# EAGLE design ion_engine (EAGLE 9.5.0)
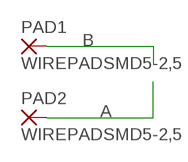
[diagram p0: schematic, sheet 1]

## Parts
PAD1  WIREPADSMD5-2,5  [5-2,5]
PAD2  WIREPADSMD5-2,5  [5-2,5]

## Nets
A: PAD2.1(P)
B: PAD1.1(P)

## Library data of the parts
PAD1 PAD2 = wirepad:WIREPAD: Wire PAD connect wire on PCB

## Board
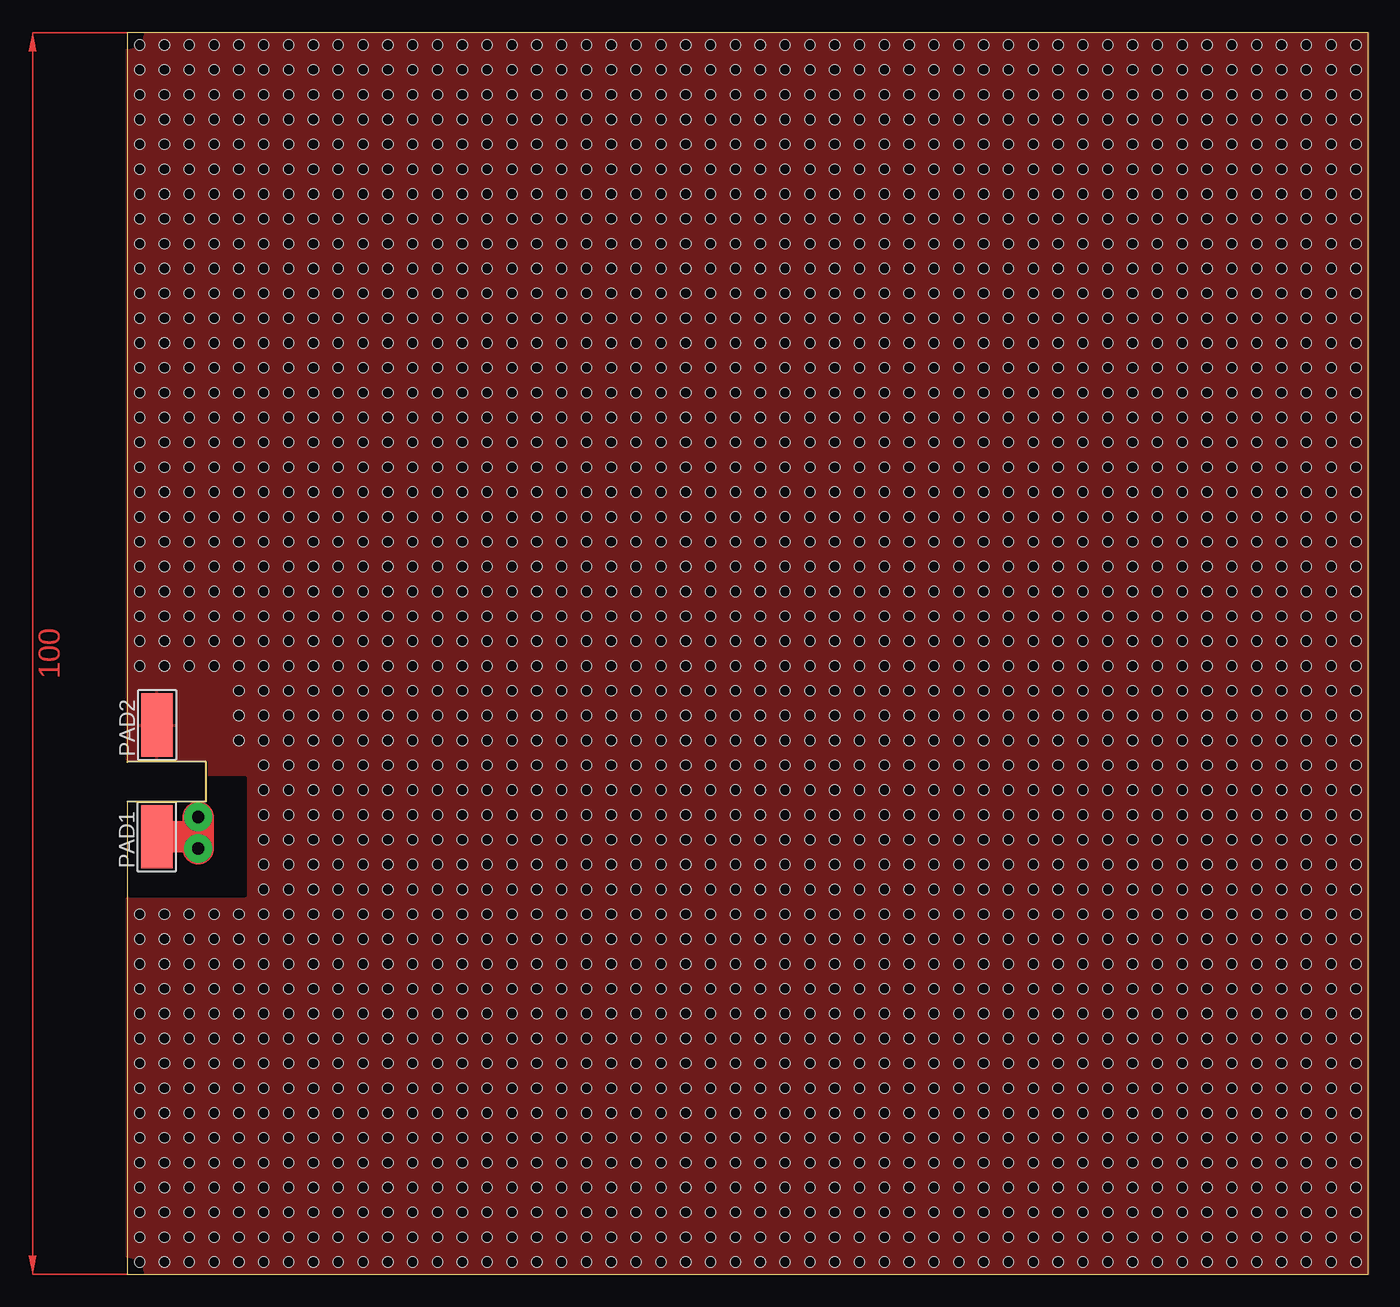
[diagram p1: board, top side]
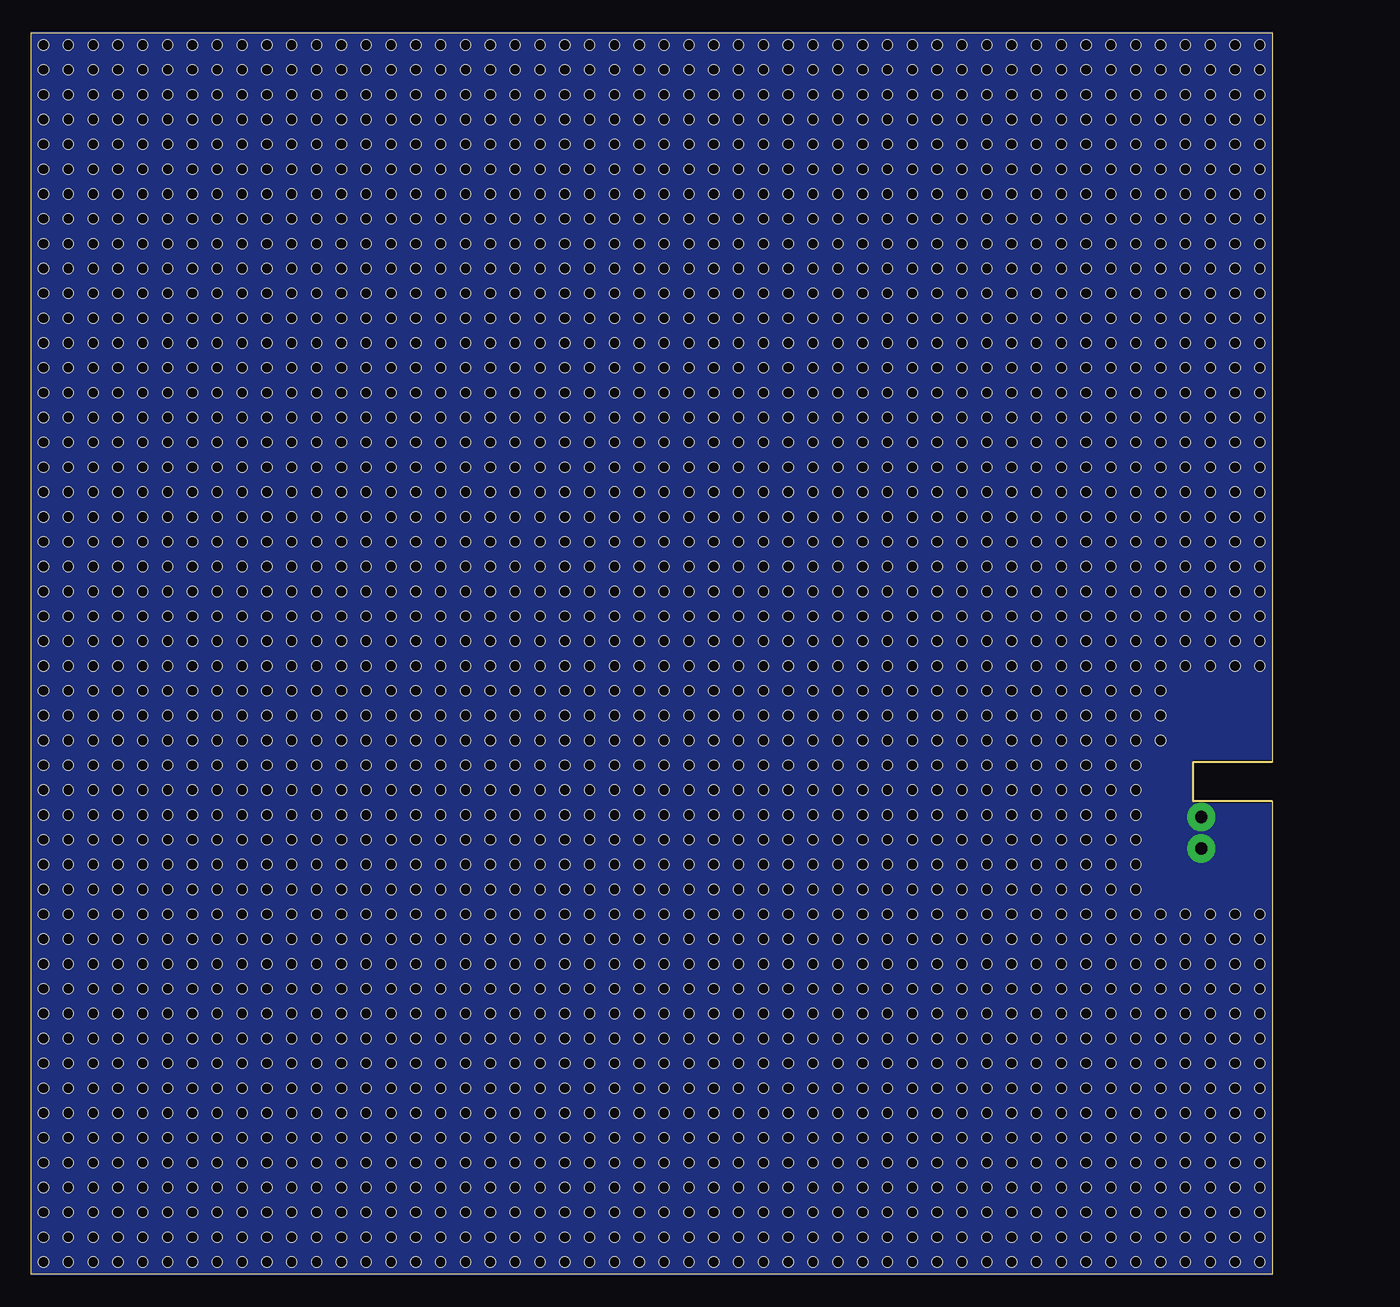
[diagram p2: board, bottom side, seen from below]

Size 100 x 100 mm. Coordinates in mm from the lower left corner, seen from the top.
Outline: 0,0 100,0 100,100 0,100 0,41.27 6.35,41.27 6.35,38.1 0,38.1 0,0
Copper layers (1*16): Top 0.035mm / dielectric 1.5mm / Bottom 0.035mm
Design rules "default *": minimum track width 6mil, minimum drill 0.35mm, track to track 50mil, track to pad 50mil, pad to pad 50mil, via to via 50mil, smd to smd 0mil, copper to edge 0mil, drill to drill 0mil, minimum pad ring 10mil, minimum via ring 8mil, stop-mask expansion 4mil, vias tented up to drill 0mil, thermal gap 10mil
Holes 0.8 mm at 1,99 3,99 5,99 7,99 9,99 11,99 13,99 15,99 17,99 19,99 21,99 23,99 25,99 27,99 27,99 29,99 31,99 33,99 35,99 37,99 39,99 41,99 43,99 45,99 47,99 49,99 51,99 53,99 55,99 55,99 57,99 59,99 61,99 61,99 63,99 65,99 67,99 69,99 71,99 73,99 75,99 77,99 79,99 79,99 81,99 83,99 85,99 87,99 89,99 91,99 93,99 95,99 97,99 99,99 1,97 3,97 5,97 7,97 9,97 11,97 13,97 15,97 17,97 19,97 21,97 23,97 25,97 27,97 27,97 29,97 31,97 33,97 35,97 37,97 39,97 41,97 43,97 45,97 47,97 49,97 51,97 53,97 55,97 55,97 57,97 59,97 61,97 61,97 63,97 65,97 67,97 69,97 71,97 73,97 75,97 77,97 79,97 79,97 81,97 83,97 85,97 87,97 89,97 91,97 93,97 95,97 97,97 99,97 1,95 3,95 5,95 7,95 9,95 11,95 13,95 15,95 17,95 19,95 21,95 23,95 25,95 27,95 27,95 29,95 31,95 33,95 35,95 37,95 39,95 41,95 43,95 45,95 47,95 49,95 51,95 53,95 55,95 55,95 57,95 59,95 61,95 61,95 63,95 65,95 67,95 69,95 71,95 73,95 75,95 77,95 79,95 79,95 81,95 83,95 85,95 87,95 89,95 91,95 93,95 95,95 97,95 99,95 1,93 3,93 5,93 7,93 9,93 11,93 13,93 15,93 17,93 19,93 21,93 23,93 25,93 27,93 27,93 29,93 31,93 33,93 35,93 37,93 39,93 41,93 43,93 45,93 47,93 49,93 51,93 53,93 55,93 55,93 57,93 59,93 61,93 61,93 63,93 65,93 67,93 69,93 71,93 73,93 75,93 77,93 79,93 79,93 81,93 83,93 85,93 87,93 89,93 91,93 93,93 95,93 97,93 99,93 1,91 3,91 5,91 7,91 9,91 11,91 13,91 15,91 17,91 19,91 21,91 23,91 25,91 27,91 27,91 29,91 31,91 33,91 35,91 37,91 39,91 41,91 43,91 45,91 47,91 49,91 51,91 53,91 55,91 55,91 57,91 59,91 61,91 61,91 63,91 65,91 67,91 69,91 71,91 73,91 75,91 77,91 79,91 79,91 81,91 83,91 85,91 87,91 89,91 91,91 93,91 95,91 97,91 99,91 1,89 3,89 5,89 7,89 9,89 11,89 13,89 15,89 17,89 19,89 21,89 23,89 25,89 27,89 27,89 29,89 31,89 33,89 35,89 37,89 39,89 41,89 43,89 45,89 47,89 49,89 51,89 53,89 55,89 55,89 57,89 59,89 61,89 61,89 63,89 65,89 67,89 69,89 71,89 73,89 75,89 77,89 79,89 79,89 81,89 83,89 85,89 87,89 89,89 91,89 93,89 95,89 97,89 99,89 1,87 3,87 5,87 7,87 9,87 11,87 13,87 15,87 17,87 19,87 21,87 23,87 25,87 27,87 27,87 29,87 31,87 33,87 35,87 37,87 39,87 41,87 43,87 45,87 47,87 49,87 51,87 53,87 55,87 55,87 57,87 59,87 61,87 61,87 63,87 65,87 67,87 69,87 71,87 73,87 75,87 77,87 79,87 79,87 81,87 83,87 85,87 87,87 89,87 91,87 93,87 95,87 97,87 99,87 1,85 3,85 5,85 7,85 9,85 11,85 13,85 15,85 17,85 19,85 21,85 23,85 25,85 27,85 27,85 29,85 31,85 33,85 35,85 37,85 39,85 41,85 43,85 45,85 47,85 49,85 51,85 53,85 55,85 55,85 57,85 59,85 61,85 61,85 63,85 65,85 67,85 69,85 71,85 73,85 75,85 77,85 79,85 79,85 81,85 83,85 85,85 87,85 89,85 91,85 93,85 95,85 97,85 99,85 1,83 3,83 5,83 7,83 9,83 11,83 13,83 15,83 17,83 19,83 21,83 23,83 25,83 27,83 27,83 29,83 31,83 33,83 35,83 37,83 39,83 41,83 43,83 45,83 47,83 49,83 51,83 53,83 55,83 55,83 57,83 59,83 61,83 61,83 63,83 65,83 67,83 69,83 71,83 73,83 75,83 77,83 79,83 79,83 81,83 83,83 85,83 87,83 89,83 91,83 93,83 95,83 97,83 99,83 1,81 3,81 5,81 7,81 9,81 11,81 13,81 15,81 17,81 19,81 21,81 23,81 25,81 27,81 27,81 29,81 31,81 33,81 35,81 37,81 39,81 41,81 43,81 45,81 47,81 49,81 51,81 53,81 55,81 55,81 57,81 59,81 61,81 61,81 63,81 65,81 67,81 69,81 71,81 73,81 75,81 77,81 79,81 79,81 81,81 83,81 85,81 87,81 89,81 91,81 93,81 95,81 97,81 99,81 1,79 3,79 5,79 7,79 9,79 11,79 13,79 15,79 17,79 19,79 21,79 23,79 25,79 27,79 27,79 29,79 31,79 33,79 35,79 37,79 39,79 41,79 43,79 45,79 47,79 49,79 51,79 53,79 55,79 55,79 57,79 59,79 61,79 61,79 63,79 65,79 67,79 69,79 71,79 73,79 75,79 77,79 79,79 79,79 81,79 83,79 85,79 87,79 89,79 91,79 93,79 95,79 97,79 99,79 1,77 3,77 5,77 7,77 9,77 11,77 13,77 15,77 17,77 19,77 21,77 23,77 25,77 27,77 27,77 29,77 31,77 33,77 35,77 37,77 39,77 41,77 43,77 45,77 47,77 49,77 51,77 53,77 55,77 55,77 57,77 59,77 61,77 61,77 63,77 65,77 67,77 69,77 71,77 73,77 75,77 77,77 79,77 79,77 81,77 83,77 85,77 87,77 89,77 91,77 93,77 95,77 97,77 99,77 1,75 3,75 5,75 7,75 9,75 11,75 13,75 15,75 17,75 19,75 21,75 23,75 25,75 27,75 27,75 29,75 31,75 33,75 35,75 37,75 39,75 41,75 43,75 45,75 47,75 49,75 51,75 53,75 55,75 55,75 57,75 59,75 61,75 61,75 63,75 65,75 67,75 69,75 71,75 73,75 75,75 77,75 79,75 79,75 81,75 83,75 85,75 87,75 89,75 91,75 93,75 95,75 97,75 99,75 1,73 3,73 5,73 7,73 9,73 11,73 13,73 15,73 17,73 19,73 21,73 23,73 25,73 27,73 27,73 29,73 31,73 33,73 35,73 37,73 39,73 41,73 43,73 45,73 47,73 49,73 51,73 53,73 55,73 55,73 57,73 59,73 61,73 61,73 63,73 65,73 67,73 69,73 71,73 73,73 75,73 77,73 79,73 79,73 81,73 83,73 85,73 87,73 89,73 91,73 93,73 95,73 97,73 99,73 1,71 3,71 5,71 7,71 9,71 11,71 13,71 15,71 17,71 19,71 21,71 23,71 25,71 27,71 27,71 29,71 31,71 33,71 35,71 37,71 39,71 41,71 43,71 45,71 47,71 49,71 51,71 53,71 55,71 55,71 57,71 59,71 61,71 61,71 63,71 65,71 67,71 69,71 71,71 73,71 75,71 77,71 79,71 79,71 81,71 83,71 85,71 87,71 89,71 91,71 93,71 95,71 97,71 99,71 1,69 3,69 5,69 7,69 9,69 11,69 13,69 15,69 17,69 19,69 21,69 23,69 25,69 27,69 27,69 29,69 31,69 33,69 35,69 37,69 39,69 41,69 43,69 45,69 47,69 49,69 51,69 53,69 55,69 55,69 57,69 59,69 61,69 61,69 63,69 65,69 67,69 69,69 71,69 73,69 75,69 77,69 79,69 79,69 81,69 83,69 85,69 87,69 89,69 91,69 93,69 95,69 97,69 99,69 1,67 3,67 5,67 7,67 9,67 11,67 13,67 15,67 17,67 19,67 21,67 23,67 25,67 27,67 27,67 29,67 31,67 33,67 35,67 37,67 39,67 41,67 43,67 45,67 47,67 49,67 51,67 53,67 55,67 55,67 57,67 59,67 61,67 61,67 63,67 65,67 67,67 69,67 71,67 73,67 75,67 77,67 79,67 79,67 81,67 83,67 85,67 87,67 89,67 91,67 93,67 95,67 97,67 99,67 1,65 3,65 5,65 7,65 9,65 11,65 13,65 15,65 17,65 19,65 21,65 23,65 25,65 27,65 27,65 29,65 31,65 33,65 35,65 37,65 39,65 41,65 43,65 45,65 47,65 49,65 51,65 53,65 55,65 55,65 57,65 59,65 61,65 61,65 63,65 65,65 67,65 69,65 71,65 73,65 75,65 77,65 79,65 79,65 81,65 83,65 85,65 87,65 89,65 91,65 93,65 95,65 97,65 99,65 1,63 3,63 5,63 7,63 9,63 11,63 13,63 15,63 17,63 19,63 21,63 23,63 25,63 27,63 27,63 29,63 31,63 33,63 35,63 37,63 39,63 41,63 43,63 45,63 47,63 49,63 51,63 53,63 55,63 55,63 57,63 59,63 61,63 61,63 63,63 65,63 67,63 69,63 71,63 73,63 75,63 77,63 79,63 79,63 81,63 83,63 85,63 87,63 89,63 91,63 93,63 95,63 97,63 99,63 1,61 3,61 5,61 7,61 9,61 11,61 13,61 15,61 17,61 19,61 21,61 23,61 25,61 27,61 27,61 29,61 31,61 33,61 35,61 37,61 39,61 41,61 43,61 45,61 47,61 49,61 51,61 53,61 55,61 55,61 57,61 59,61 61,61 61,61 63,61 65,61 67,61 69,61 71,61 73,61 75,61 77,61 79,61 79,61 81,61 83,61 85,61 87,61 89,61 91,61 93,61 95,61 97,61 99,61 1,59 3,59 5,59 7,59 9,59 11,59 13,59 15,59 17,59 19,59 21,59 23,59 25,59 27,59 27,59 29,59 31,59 33,59 35,59 37,59 39,59 41,59 43,59 45,59 47,59 49,59 51,59 53,59 55,59 55,59 57,59 59,59 61,59 61,59 63,59 65,59 67,59 69,59 71,59 73,59 75,59 77,59 79,59 79,59 81,59 83,59 85,59 87,59 89,59 91,59 93,59 95,59 97,59 99,59 1,57 3,57 5,57 7,57 9,57 11,57 13,57 15,57 17,57 19,57 21,57 23,57 25,57 27,57 27,57 29,57 31,57 33,57 35,57 37,57 39,57 41,57 43,57 45,57 47,57 49,57 51,57 53,57 55,57 55,57 57,57 59,57 61,57 61,57 63,57 65,57 67,57 69,57 71,57 73,57 75,57 77,57 79,57 79,57 81,57 83,57 85,57 87,57 89,57 91,57 93,57 95,57 97,57 99,57 1,55 3,55 5,55 7,55 9,55 11,55 13,55 15,55 17,55 19,55 21,55 23,55 25,55 27,55 27,55 29,55 31,55 33,55 35,55 37,55 39,55 41,55 43,55 45,55 47,55 49,55 51,55 53,55 55,55 55,55 57,55 59,55 61,55 61,55 63,55 65,55 67,55 69,55 71,55 73,55 75,55 77,55 79,55 79,55 81,55 83,55 85,55 87,55 89,55 91,55 93,55 95,55 97,55 99,55 1,53 3,53 5,53 7,53 9,53 11,53 13,53 15,53 17,53 19,53 21,53 23,53 25,53 27,53 27,53 29,53 31,53 33,53 35,53 37,53 39,53 41,53 43,53 45,53 47,53 49,53 51,53 53,53 55,53 55,53 57,53 59,53 61,53 61,53 63,53 65,53 67,53 69,53 71,53 73,53 75,53 77,53 79,53 79,53 81,53 83,53 85,53 87,53 89,53 91,53 93,53 95,53 97,53 99,53 1,51 3,51 5,51 7,51 9,51 11,51 13,51 15,51 17,51 19,51 21,51 23,51 25,51 27,51 27,51 29,51 31,51 33,51 35,51 37,51 39,51 41,51 43,51 45,51 47,51 49,51 51,51 53,51 55,51 55,51 57,51 59,51 61,51 61,51 63,51 65,51 67,51 69,51 71,51 73,51 75,51 77,51 79,51 79,51 81,51 83,51 85,51 87,51 89,51 91,51 93,51 95,51 97,51 99,51 1,49 3,49 5,49 7,49 9,49 11,49 13,49 15,49 17,49 19,49 21,49 23,49 25,49 27,49 27,49 29,49 31,49 33,49 35,49 37,49 39,49 41,49 43,49 45,49 47,49 49,49 51,49 53,49 55,49 55,49 57,49 59,49 61,49 61,49 63,49 65,49 67,49 69,49 71,49 73,49 75,49 77,49 79,49 79,49 81,49 83,49 85,49 87,49 89,49 91,49 93,49 95,49 97,49 99,49 9,47 11,47 13,47 15,47 17,47 19,47 21,47 23,47 25,47 27,47 27,47 29,47 31,47 33,47 35,47 37,47 39,47 41,47 43,47 45,47 47,47 49,47 51,47 53,47 55,47 55,47 57,47 59,47 61,47 61,47 63,47 65,47 67,47 69,47 71,47 73,47 75,47 77,47 79,47 79,47 81,47 83,47 85,47 87,47 89,47 91,47 93,47 95,47 97,47 99,47 9,45 11,45 13,45 15,45 17,45 19,45 21,45 23,45 25,45 27,45 27,45 29,45 31,45 33,45 35,45 37,45 39,45 41,45 43,45 45,45 47,45 49,45 51,45 53,45 55,45 55,45 57,45 59,45 61,45 61,45 63,45 65,45 67,45 69,45 71,45 73,45 75,45 77,45 79,45 79,45 81,45 83,45 85,45 87,45 89,45 91,45 93,45 95,45 97,45 99,45 9,43 11,43 13,43 15,43 17,43 19,43 21,43 23,43 25,43 27,43 27,43 29,43 31,43 33,43 35,43 37,43 39,43 41,43 43,43 45,43 47,43 49,43 51,43 53,43 55,43 55,43 57,43 59,43 61,43 61,43 63,43 65,43 67,43 69,43 71,43 73,43 75,43 77,43 79,43 79,43 81,43 83,43 85,43 87,43 89,43 91,43 93,43 95,43 97,43 99,43 11,41 13,41 15,41 17,41 19,41 21,41 23,41 25,41 27,41 27,41 29,41 31,41 33,41 35,41 37,41 39,41 41,41 43,41 45,41 47,41 49,41 51,41 53,41 55,41 55,41 57,41 59,41 61,41 61,41 63,41 65,41 67,41 69,41 71,41 73,41 75,41 77,41 79,41 79,41 81,41 83,41 85,41 87,41 89,41 91,41 93,41 95,41 97,41 99,41 11,39 13,39 15,39 17,39 19,39 21,39 23,39 25,39 27,39 27,39 29,39 31,39 33,39 35,39 37,39 39,39 41,39 43,39 45,39 47,39 49,39 51,39 53,39 55,39 55,39 57,39 59,39 61,39 61,39 63,39 65,39 67,39 69,39 71,39 73,39 75,39 77,39 79,39 79,39 81,39 83,39 85,39 87,39 89,39 91,39 93,39 95,39 97,39 99,39 11,37 13,37 15,37 17,37 19,37 21,37 23,37 25,37 27,37 27,37 29,37 31,37 33,37 35,37 37,37 39,37 41,37 43,37 45,37 47,37 49,37 51,37 53,37 55,37 55,37 57,37 59,37 61,37 61,37 63,37 65,37 67,37 69,37 71,37 73,37 75,37 77,37 79,37 79,37 81,37 83,37 85,37 87,37 89,37 91,37 93,37 95,37 97,37 99,37 11,35 13,35 15,35 17,35 19,35 21,35 23,35 25,35 27,35 27,35 29,35 31,35 33,35 35,35 37,35 39,35 41,35 43,35 45,35 47,35 49,35 51,35 53,35 55,35 55,35 57,35 59,35 61,35 61,35 63,35 65,35 67,35 69,35 71,35 73,35 75,35 77,35 79,35 79,35 81,35 83,35 85,35 87,35 89,35 91,35 93,35 95,35 97,35 99,35 11,33 13,33 15,33 17,33 19,33 21,33 23,33 25,33 27,33 27,33 29,33 31,33 33,33 35,33 37,33 39,33 41,33 43,33 45,33 47,33 49,33 51,33 53,33 55,33 55,33 57,33 59,33 61,33 61,33 63,33 65,33 67,33 69,33 71,33 73,33 75,33 77,33 79,33 79,33 81,33 83,33 85,33 87,33 89,33 91,33 93,33 95,33 97,33 99,33 11,31 13,31 15,31 17,31 19,31 21,31 23,31 25,31 27,31 27,31 29,31 31,31 33,31 35,31 37,31 39,31 41,31 43,31 45,31 47,31 49,31 51,31 53,31 55,31 55,31 57,31 59,31 61,31 61,31 63,31 65,31 67,31 69,31 71,31 73,31 75,31 77,31 79,31 79,31 81,31 83,31 85,31 87,31 89,31 91,31 93,31 95,31 97,31 99,31 1,29 3,29 5,29 7,29 9,29 11,29 13,29 15,29 17,29 19,29 21,29 23,29 25,29 27,29 27,29 29,29 31,29 33,29 35,29 37,29 39,29 41,29 43,29 45,29 47,29 49,29 51,29 53,29 55,29 55,29 57,29 59,29 61,29 61,29 63,29 65,29 67,29 69,29 71,29 73,29 75,29 77,29 79,29 79,29 81,29 83,29 85,29 87,29 89,29 91,29 93,29 95,29 97,29 99,29 1,27 3,27 5,27 7,27 9,27 11,27 13,27 15,27 17,27 19,27 21,27 23,27 25,27 27,27 27,27 29,27 31,27 33,27 35,27 37,27 39,27 41,27 43,27 45,27 47,27 49,27 51,27 53,27 55,27 55,27 57,27 59,27 61,27 61,27 63,27 65,27 67,27 69,27 71,27 73,27 75,27 77,27 79,27 79,27 81,27 83,27 85,27 87,27 89,27 91,27 93,27 95,27 97,27 99,27 1,25 3,25 5,25 7,25 9,25 11,25 13,25 15,25 17,25 19,25 21,25 23,25 25,25 27,25 27,25 29,25 31,25 33,25 35,25 37,25 39,25 41,25 43,25 45,25 47,25 49,25 51,25 53,25 55,25 55,25 57,25 59,25 61,25 61,25 63,25 65,25 67,25 69,25 71,25 73,25 75,25 77,25 79,25 79,25 81,25 83,25 85,25 87,25 89,25 91,25 93,25 95,25 97,25 99,25 1,23 3,23 5,23 7,23 9,23 11,23 13,23 15,23 17,23 19,23 21,23 23,23 25,23 27,23 27,23 29,23 31,23 33,23 35,23 37,23 39,23 41,23 43,23 45,23 47,23 49,23 51,23 53,23 55,23 55,23 57,23 59,23 61,23 61,23 63,23 65,23 67,23 69,23 71,23 73,23 75,23 77,23 79,23 79,23 81,23 83,23 85,23 87,23 89,23 91,23 93,23 95,23 97,23 99,23 1,21 3,21 5,21 7,21 9,21 11,21 13,21 15,21 17,21 19,21 21,21 23,21 25,21 27,21 27,21 29,21 31,21 33,21 35,21 37,21 39,21 41,21 43,21 45,21 47,21 49,21 51,21 53,21 55,21 55,21 57,21 59,21 61,21 61,21 63,21 65,21 67,21 69,21 71,21 73,21 75,21 77,21 79,21 79,21 81,21 83,21 85,21 87,21 89,21 91,21 93,21 95,21 97,21 99,21 1,19 3,19 5,19 7,19 9,19 11,19 13,19 15,19 17,19 19,19 21,19 23,19 25,19 27,19 27,19 29,19 31,19 33,19 35,19 37,19 39,19 41,19 43,19 45,19 47,19 49,19 51,19 53,19 55,19 55,19 57,19 59,19 61,19 61,19 63,19 65,19 67,19 69,19 71,19 73,19 75,19 77,19 79,19 79,19 81,19 83,19 85,19 87,19 89,19 91,19 93,19 95,19 97,19 99,19 1,17 3,17 5,17 7,17 9,17 11,17 13,17 15,17 17,17 19,17 21,17 23,17 25,17 27,17 27,17 29,17 31,17 33,17 35,17 37,17 39,17 41,17 43,17 45,17 47,17 49,17 51,17 53,17 55,17 55,17 57,17 59,17 61,17 61,17 63,17 65,17 67,17 69,17 71,17 73,17 75,17 77,17 79,17 79,17 81,17 83,17 85,17 87,17 89,17 91,17 93,17 95,17 97,17 99,17 1,15 3,15 5,15 7,15 9,15 11,15 13,15 15,15 17,15 19,15 21,15 23,15 25,15 27,15 27,15 29,15 31,15 33,15 35,15 37,15 39,15 41,15 43,15 45,15 47,15 49,15 51,15 53,15 55,15 55,15 57,15 59,15 61,15 61,15 63,15 65,15 67,15 69,15 71,15 73,15 75,15 77,15 79,15 79,15 81,15 83,15 85,15 87,15 89,15 91,15 93,15 95,15 97,15 99,15 1,13 3,13 5,13 7,13 9,13 11,13 13,13 15,13 17,13 19,13 21,13 23,13 25,13 27,13 27,13 29,13 31,13 33,13 35,13 37,13 39,13 41,13 43,13 45,13 47,13 49,13 51,13 53,13 55,13 55,13 57,13 59,13 61,13 61,13 63,13 65,13 67,13 69,13 71,13 73,13 75,13 77,13 79,13 79,13 81,13 83,13 85,13 87,13 89,13 91,13 93,13 95,13 97,13 99,13 1,11 3,11 5,11 7,11 9,11 11,11 13,11 15,11 17,11 19,11 21,11 23,11 25,11 27,11 27,11 29,11 31,11 33,11 35,11 37,11 39,11 41,11 43,11 45,11 47,11 49,11 51,11 53,11 55,11 55,11 57,11 59,11 61,11 61,11 63,11 65,11 67,11 69,11 71,11 73,11 75,11 77,11 79,11 79,11 81,11 83,11 85,11 87,11 89,11 91,11 93,11 95,11 97,11 99,11 1,9 3,9 5,9 7,9 9,9 11,9 13,9 15,9 17,9 19,9 21,9 23,9 25,9 27,9 27,9 29,9 31,9 33,9 35,9 37,9 39,9 41,9 43,9 45,9 47,9 49,9 51,9 53,9 55,9 55,9 57,9 59,9 61,9 61,9 63,9 65,9 67,9 69,9 71,9 73,9 75,9 77,9 79,9 79,9 81,9 83,9 85,9 87,9 89,9 91,9 93,9 95,9 97,9 99,9 1,7 3,7 5,7 7,7 9,7 11,7 13,7 15,7 17,7 19,7 21,7 23,7 25,7 27,7 27,7 29,7 31,7 33,7 35,7 37,7 39,7 41,7 43,7 45,7 47,7 49,7 51,7 53,7 55,7 55,7 57,7 59,7 61,7 61,7 63,7 65,7 67,7 69,7 71,7 73,7 75,7 77,7 79,7 79,7 81,7 83,7 85,7 87,7 89,7 91,7 93,7 95,7 97,7 99,7 1,5 3,5 5,5 7,5 9,5 11,5 13,5 15,5 17,5 19,5 21,5 23,5 25,5 27,5 27,5 29,5 31,5 33,5 35,5 37,5 39,5 41,5 43,5 45,5 47,5 49,5 51,5 53,5 55,5 55,5 57,5 59,5 61,5 61,5 63,5 65,5 67,5 69,5 71,5 73,5 75,5 77,5 79,5 79,5 81,5 83,5 85,5 87,5 89,5 91,5 93,5 95,5 97,5 99,5 1,3 3,3 5,3 7,3 9,3 11,3 13,3 15,3 17,3 19,3 21,3 23,3 25,3 27,3 27,3 29,3 31,3 33,3 35,3 37,3 39,3 41,3 43,3 45,3 47,3 49,3 51,3 53,3 55,3 55,3 57,3 59,3 61,3 61,3 63,3 65,3 67,3 69,3 71,3 73,3 75,3 77,3 79,3 79,3 81,3 83,3 85,3 87,3 89,3 91,3 93,3 95,3 97,3 99,3 1,1 3,1 5,1 7,1 9,1 11,1 13,1 15,1 17,1 19,1 21,1 23,1 25,1 27,1 27,1 29,1 31,1 33,1 35,1 37,1 39,1 41,1 43,1 45,1 47,1 49,1 51,1 53,1 55,1 55,1 57,1 59,1 61,1 61,1 63,1 65,1 67,1 69,1 71,1 73,1 75,1 77,1 79,1 79,1 81,1 83,1 85,1 87,1 89,1 91,1 93,1 95,1 97,1 99,1

### Footprints (pad centres in the part's own frame; a part is rotated, then mirrored left to right if it is on the bottom)
5-2,5 = smd 2.54 x 5.08: 1 0,0

### Placement (x,y rotation side)
PAD1  2.38,35.24 0 top
PAD2  2.41,44.24 0 top

### Tracks (layer width: path | path; a pad name or v marks a point on that pad's centre or on a via)
A
  pour Top (rank 2): 0,100 100,100 100,0 0,0
  cutout Top: 0,30.48 9.53,30.48 9.53,40.01 6.35,40.01 6.35,38.1 0,38.1
  cutout Top: 0,41.27 6.35,41.27 6.35,38.1 0,38.1
B  (via drill 1 pad 2.29)
  Top 2.54: PAD1.1 5.71,35.24 | 5.71,35.24 v5.71,34.29 | PAD1.1 5.71,35.24 | 5.71,35.24 5.71,35.74 | v5.71,36.83 5.71,35.24 | 5.71,35.24 PAD1.1
  pour Bottom: 0,100 100,100 100,0 0,0
  cutout Bottom: 0,41.27 6.35,41.27 6.35,38.1 0,38.1
(copper drawn outside any net)
  shapes: Top area x1